# EAGLE schematic Axion (EAGLE 7.7.0)
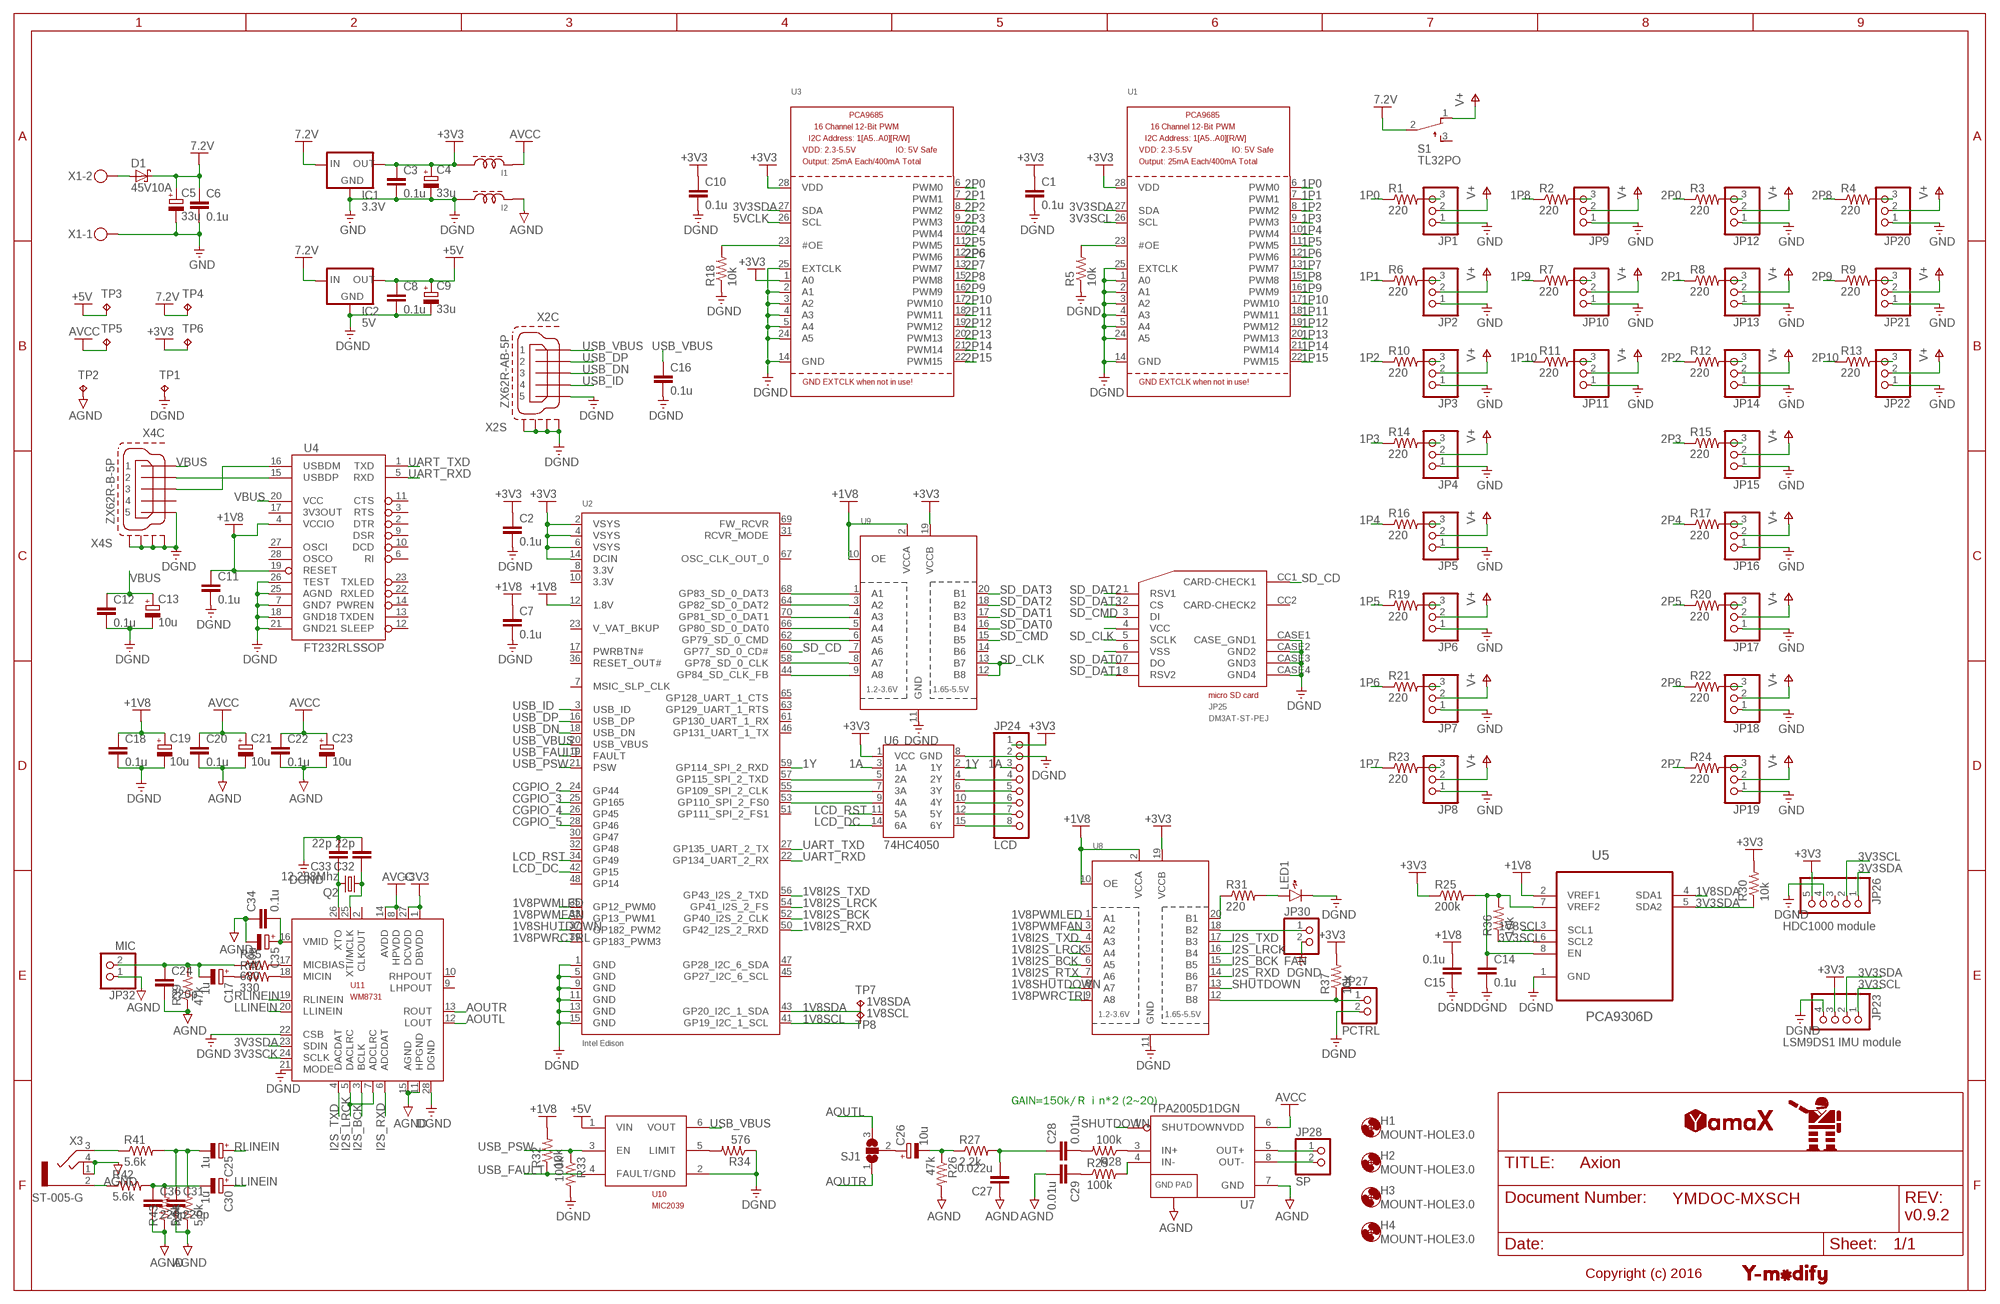
[diagram p0: schematic, sheet 1]

## Parts
C1  0.1u  C-EUC1608  [C1608]
C2  0.1u  C-EUC1608  [C1608]
C3  0.1u  C-EUC1608  [C1608]
C4  33u  CPOL-EUE2-5  [E2-5]
C5  33u  CPOL-EUE2-5  [E2-5]
C6  0.1u  C-EUC1608  [C1608]
C7  0.1u  C-EUC1608  [C1608]
C8  0.1u  C-EUC1608  [C1608]
C9  33u  CPOL-EUE2-5  [E2-5]
C10  0.1u  C-EUC1608  [C1608]
C11  0.1u  C-EUC1608  [C1608]
C12  0.1u  C-EUC1608  [C1608]
C13  10u  CPOL-EUE2-5  [E2-5]
C14  0.1u  C-EUC1608  [C1608]
C15  0.1u  C-EUC1608  [C1608]
C16  0.1u  C-EUC1608  [C1608]
C17  1u  CPOL-EUE2-5  [E2-5]
C18  0.1u  C-EUC1608  [C1608]
C19  10u  CPOL-EUE2-5  [E2-5]
C20  0.1u  C-EUC1608  [C1608]
C21  10u  CPOL-EUE2-5  [E2-5]
C22  0.1u  C-EUC1608  [C1608]
C23  10u  CPOL-EUE2-5  [E2-5]
C24  220p  C-EUC0805  [C0805]
C25  1u  CPOL-EUE2-5  [E2-5]
C26  10u  CPOL-EUE2-5  [E2-5]
C27  0.022u  C-EUC1608  [C1608]
C28  0.01u  C-EUC1608  [C1608]
C29  0.01u  C-EUC1608  [C1608]
C30  1u  CPOL-EUE2-5  [E2-5]
C31  220p  C-EUC0805  [C0805]
C32  22p  C-EUC1608  [C1608]
C33  22p  C-EUC1608  [C1608]
C34  0.1u  C-EUC1608  [C1608]
C35  10u  CPOL-EUE2-5  [E2-5]
C36  220p  C-EUC0805  [C0805]
D1  45V10A  SCHOTTKY-DIODEDO201T15  [DO201T15]
H1  MOUNT-HOLE3.0  [3,0]
H2  MOUNT-HOLE3.0  [3,0]
H3  MOUNT-HOLE3.0  [3,0]
H4  MOUNT-HOLE3.0  [3,0]
I1  BLM18  [1608(1.6*0.8MM)]
I2  BLM18  [1608(1.6*0.8MM)]
IC1  3.3V  78XXS  [78XXS]
IC2  5V  78XXS  [78XXS]
JP1  PINHD-1X3  [1X03]
JP2  PINHD-1X3  [1X03]
JP3  PINHD-1X3  [1X03]
JP4  PINHD-1X3  [1X03]
JP5  PINHD-1X3  [1X03]
JP6  PINHD-1X3  [1X03]
JP7  PINHD-1X3  [1X03]
JP8  PINHD-1X3  [1X03]
JP9  PINHD-1X3  [1X03]
JP10  PINHD-1X3  [1X03]
JP11  PINHD-1X3  [1X03]
JP12  PINHD-1X3  [1X03]
JP13  PINHD-1X3  [1X03]
JP14  PINHD-1X3  [1X03]
JP15  PINHD-1X3  [1X03]
JP16  PINHD-1X3  [1X03]
JP17  PINHD-1X3  [1X03]
JP18  PINHD-1X3  [1X03]
JP19  PINHD-1X3  [1X03]
JP20  PINHD-1X3  [1X03]
JP21  PINHD-1X3  [1X03]
JP22  PINHD-1X3  [1X03]
JP23  LSM9DS1 IMU module  PINHD-1X4  [1X04]
JP24  LCD  PINHD-1X8  [1X08]
JP25  DM3AT-ST-PEJ  [DM3AT-SF-PEJ]
JP26  HDC1000 module  PINHD-1X5  [1X05]
JP27  PCTRL  PINHD-1X2  [1X02]
JP28  SP  PINHD-1X2  [1X02]
JP30  FAN  PINHD-1X2  [1X02]
JP32  MIC  PINHD-1X2  [1X02]
LED1  LED1608  [LED1608]
Q2  12.288Mhz  CRYSTALHC49S  [HC49/S]
R1  220  R-US_M1206  [M1206]
R2  220  R-US_M1206  [M1206]
R3  220  R-US_M1206  [M1206]
R4  220  R-US_M1206  [M1206]
R5  10k  R-US_M1206  [M1206]
R6  220  R-US_M1206  [M1206]
R7  220  R-US_M1206  [M1206]
R8  220  R-US_M1206  [M1206]
R9  220  R-US_M1206  [M1206]
R10  220  R-US_M1206  [M1206]
R11  220  R-US_M1206  [M1206]
R12  220  R-US_M1206  [M1206]
R13  220  R-US_M1206  [M1206]
R14  220  R-US_M1206  [M1206]
R15  220  R-US_M1206  [M1206]
R16  220  R-US_M1206  [M1206]
R17  220  R-US_M1206  [M1206]
R18  10k  R-US_M1206  [M1206]
R19  220  R-US_M1206  [M1206]
R20  220  R-US_M1206  [M1206]
R21  220  R-US_M1206  [M1206]
R22  220  R-US_M1206  [M1206]
R23  220  R-US_M1206  [M1206]
R24  220  R-US_M1206  [M1206]
R25  200k  R-US_0309/V  [0309V]
R26  47k  R-US_R0603  [R0603]
R27  2.2k  R-US_R1206  [R1206]
R28  100k  R-US_R0603  [R0603]
R29  100k  R-US_R0603  [R0603]
R30  10k  R-US_M1206  [M1206]
R31  220  R-US_M1206  [M1206]
R32  10k  R-US_M1206  [M1206]
R33  100k  R-US_R0603  [R0603]
R34  576  R-US_M1206  [M1206]
R35  680  R-US_R1206  [R1206]
R36  10k  R-US_M1206  [M1206]
R37  10k  R-US_M1206  [M1206]
R39  47k  R-US_R0603  [R0603]
R40  330  R-US_R1206  [R1206]
R41  5.6k  R-US_R1206  [R1206]
R42  5.6k  R-US_R1206  [R1206]
R43  5.6k  R-US_R1206  [R1206]
R44  5.6k  R-US_R1206  [R1206]
S1  TL32PO  [TL3XPO]
SJ1  SJ2W  [SJ_2]
TP1  TESTPAD-R-AUTO-0.5  [ROUND-AUTO-0.5]
TP2  TESTPAD-R-AUTO-0.5  [ROUND-AUTO-0.5]
TP3  TESTPAD-R-AUTO-0.5  [ROUND-AUTO-0.5]
TP4  TESTPAD-R-AUTO-0.5  [ROUND-AUTO-0.5]
TP5  TESTPAD-R-AUTO-0.5  [ROUND-AUTO-0.5]
TP6  TESTPAD-R-AUTO-0.5  [ROUND-AUTO-0.5]
TP7  TESTPAD-R-AUTO-0.5  [ROUND-AUTO-0.5]
TP8  TESTPAD-R-AUTO-0.5  [ROUND-AUTO-0.5]
U1  PCA9685  [TSSOP28]
U2  Intel Edison  EDISON_CONNECTOR_FULLMOUNTING_HOLES  [EDISON_DAUGHTER]
U3  PCA9685  [TSSOP28]
U4  FT232RLSSOP  [SSOP28DB]
U5  PCA9306D  PCA9306D,118  [SOIC127P600X175-8N]
U6  74HC4050  HEX_CONVERTER  [SO016]
U7  TPA2005D1DGN  [POWER-SOP8]
U8  TXB0108PWR  [TSSOP20]
U9  TXB0108PWR  [TSSOP20]
U10  MIC2039  [SOT23-6]
U11  WM8731  [SSOP28]
U$1  Y-MODIFY  [Y-MODIFY]
U$2  YAMAX  [YAMAX]
U$4  MON  [MON]
X1  MKDSN1,5/2-5,08  [MKDSN1,5/2-5,08]
X2  ZX62R-AB-5P  [ZX62R-AB-5P]
X3  ST-005-G  [ST-005-G]
X4  ZX62R-B-5P  [ZX62R-B-5P]

## Nets
1A: JP24.3 U6.3(1A)
1P0: R1.1 U1.6(PWM0)
1P1: R6.1 U1.7(PWM1)
1P2: R10.1 U1.8(PWM2)
1P3: R14.1 U1.9(PWM3)
1P4: R16.1 U1.10(PWM4)
1P5: R19.1 U1.11(PWM5)
1P6: R21.1 U1.12(PWM6)
1P7: R23.1 U1.13(PWM7)
1P8: R2.1 U1.15(PWM8)
1P9: R7.1 U1.16(PWM9)
1P10: R11.1 U1.17(PWM10)
1P11: U1.18(PWM11)
1P12: U1.19(PWM12)
1P13: U1.20(PWM13)
1P14: U1.21(PWM14)
1P15: U1.22(PWM15)
1V8I2S_BCK: U2.52(GP40_I2S_2_CLK) U8.6(A5)
1V8I2S_LRCK: U2.54(GP41_I2S_2_FS) U8.5(A4)
1V8I2S_RTX: U8.7(A6)
1V8I2S_RXD: U2.50(GP42_I2S_2_RXD)
1V8I2S_TXD: U2.56(GP43_I2S_2_TXD) U8.4(A3)
1V8PWMFAN: U2.33(GP13_PWM1) U8.3(A2)
1V8PWMLED: U2.35(GP12_PWM0) U8.1(A1)
1V8PWRCTRL: U2.39(GP183_PWM3) U8.9(A8)
1V8SCL: TP8.TP U2.41(GP19_I2C_1_SCL) U5.3(SCL1)
1V8SDA: TP7.TP U2.43(GP20_I2C_1_SDA) U5.4(SDA1)
1V8SHUTDOWN: U2.37(GP182_PWM2) U8.8(A7)
1Y: U2.59(GP114_SPI_2_RXD) U6.2(1Y)
2P0: R3.1 U3.6(PWM0)
2P1: R8.1 U3.7(PWM1)
2P2: R12.1 U3.8(PWM2)
2P3: R15.1 U3.9(PWM3)
2P4: R17.1 U3.10(PWM4)
2P5: R20.1 U3.11(PWM5)
2P6: R22.1 U3.12(PWM6)
2P7: R24.1 U3.13(PWM7)
2P8: R4.1 U3.15(PWM8)
2P9: R9.1 U3.16(PWM9)
2P10: R13.1 U3.17(PWM10)
2P11: U3.18(PWM11)
2P12: U3.19(PWM12)
2P13: U3.20(PWM13)
2P14: U3.21(PWM14)
2P15: U3.22(PWM15)
3V3SCK: U11.24(SCLK)
3V3SCL: JP23.1 JP26.2 R36.1 U1.26(SCL) U5.6(SCL2)
3V3SDA: JP23.2 JP26.1 R30.1 U1.27(SDA) U3.27(SDA) U5.5(SDA2) U11.23(SDIN)
5VCLK: U3.26(SCL)
+1V8: C7.1 C11.1 C15.2 C18.1 C19.+ R32.2 U2.12(1.8V) U4.4(VCCIO) U4.19(RESET) U5.2(VREF1) U8.2(VCCA) U8.10(OE) U9.2(VCCA) U9.10(OE)
+3V3 [power]: C1.1 C2.1 C3.1 C4.+ C10.1 I1.P$3 IC1.OUT JP23.3 JP24.1 JP26.5 R25.1 R30.2 R37.2 TP6.TP U1.28(VDD) U2.2(VSYS) U2.4(VSYS) U2.6(VSYS) U2.14(DCIN) U3.1(A0) U3.28(VDD) U6.1(VCC) U8.19(VCCB) U9.19(VCCB) U11.1(DBVDD) U11.27(DCVDD)
+5V [power]: C8.1 C9.+ IC2.OUT TP3.TP U10.1(VIN)
AGND [power]: C20.2 C21.- C22.2 C23.- C24.2 C27.1 C29.2 C31.2 C34.1 C35.- C36.2 I2.P$4 JP32.1 R26.2 R39.1 R43.1 R44.1 TP2.TP U7.7(GND) U7.9(GND) U11.11(HPGND) U11.15(AGND) X3.1 X3.4
AOUTL: SJ1.3 U11.12(LOUT)
AOUTR: SJ1.1 U11.13(ROUT)
AVCC [power]: C20.1 C21.+ C22.1 C23.+ I1.P$4 TP5.TP U7.6(VDD) U11.8(HPVDD) U11.14(AVDD)
CGPIO_2: U2.24(GP44)
CGPIO_3: U2.25(GP165)
CGPIO_4: U2.26(GP45)
CGPIO_5: U2.28(GP46)
DGND [power]: C1.2 C2.2 C7.2 C8.2 C9.- C10.2 C11.2 C12.2 C13.- C14.2 C15.1 C16.2 C18.2 C19.- C32.2 C33.2 IC2.GND JP23.4 JP24.2 JP25.CASE1(CASE_GND1) JP25.CASE2(GND2) JP25.CASE3(GND3) JP25.CASE4(GND4) JP26.4 JP27.2 JP30.2 LED1.K R5.1 R18.1 R33.2 R34.1 TP1.TP U1.1(A0) U1.2(A1) U1.3(A2) U1.4(A3) U1.5(A4) U1.14(GND) U1.24(A5) U1.25(EXTCLK) U2.1(GND) U2.5(GND) U2.9(GND) U2.11(GND) U2.13(GND) U2.15(GND) U3.2(A1) U3.3(A2) U3.4(A3) U3.5(A4) U3.14(GND) U3.24(A5) U3.25(EXTCLK) U4.7(GND7) U4.18(GND18) U4.21(GND21) U4.25(AGND) U4.26(TEST) U5.1(GND) U6.8(GND) U8.11(GND) U9.11(GND) U10.2(GND) U11.21(MODE) U11.22(CSB) U11.28(DGND) X2.5 X2.S1(S:S1) X2.S2(S:S2) X2.S3(S:S3) X2.S4(S:S4) X4.5 X4.S1(S:S1) X4.S2(S:S2) X4.S3(S:S3) X4.S4(S:S4)
GND [motorpower]: C3.2 C4.- C5.- C6.2 I2.P$3 IC1.GND JP1.1 JP2.1 JP3.1 JP4.1 JP5.1 JP6.1 JP7.1 JP8.1 JP9.1 JP10.1 JP11.1 JP12.1 JP13.1 JP14.1 JP15.1 JP16.1 JP17.1 JP18.1 JP19.1 JP20.1 JP21.1 JP22.1 X1.1 ; supply symbol labelled DGND
I2S_BCK: U8.15(B5) U11.3(BCLK)
I2S_LRCK: U8.16(B4) U11.5(DACLRC) U11.7(ADCLRC)
I2S_RXD: U8.14(B6) U11.6(ADCDAT)
I2S_TXD: U8.17(B3) U11.4(DACDAT)
LCD_DC: U2.42(GP15) U6.14(6A)
LCD_RST: U2.34(GP49) U6.11(5A)
LLINEIN: C30.+ U11.20(LLINEIN)
N$1: JP1.3 R1.2
N$2: D1.A X1.2
N$3: JP2.3 R6.2
N$4: R5.2 U1.23(#OE)
N$5: JP3.3 R10.2
N$6: R18.2 U3.23(#OE)
N$7: JP4.3 R14.2
N$8: U4.15(USBDP) U4.16(USBDM) X4.2 X4.3
N$9: JP5.3 R16.2
N$10: C14.1 R25.2 R36.2 U5.7(VREF2) U5.8(EN)
N$11: JP6.3 R19.2
N$12: U2.53(GP110_SPI_2_FS0) U6.9(4A)
N$13: JP7.3 R21.2
N$14: U2.55(GP109_SPI_2_CLK) U6.7(3A)
N$15: JP8.3 R23.2
N$16: JP24.8 U6.15(6Y)
N$17: JP9.3 R2.2
N$18: JP10.3 R7.2
N$19: JP11.3 R11.2
N$20: JP20.3 R4.2
N$21: JP21.3 R9.2
N$22: JP22.3 R13.2
N$23: JP24.7 U6.12(5Y)
N$24: JP24.6 U6.10(4Y)
N$25: JP24.5 U6.6(3Y)
N$26: JP12.3 R3.2
N$27: JP13.3 R8.2
N$28: JP14.3 R12.2
N$29: JP15.3 R15.2
N$30: JP16.3 R17.2
N$31: JP17.3 R20.2
N$32: JP18.3 R22.2
N$33: JP19.3 R24.2
N$34: JP24.4 U6.4(2Y)
N$35: JP27.1 R37.1 U8.12(B8)
N$37: U2.68(GP83_SD_0_DAT3) U9.1(A1)
N$38: C17.+ R40.1
N$39: U2.57(GP115_SPI_2_TXD) U6.5(2A)
N$40: U2.64(GP82_SD_0_DAT2) U9.3(A2)
N$41: U2.70(GP81_SD_0_DAT1) U9.4(A3)
N$42: U2.66(GP80_SD_0_DAT0) U9.5(A4)
N$43: U2.62(GP79_SD_0_CMD) U9.6(A5)
N$44: U2.58(GP78_SD_0_CLK) U9.8(A7)
N$45: U2.44(GP84_SD_CLK_FB) U9.9(A8)
N$46: C26.+ SJ1.2
N$47: C26.- R26.1 R27.1
N$48: R28.1 U7.3(IN+)
N$49: JP25.4(VCC)
N$50: R29.2 U7.4(IN-)
N$51: JP25.6(VSS)
N$52: C28.2 R28.2
N$53: C29.1 R29.1
N$54: C27.2 C28.1 R27.2
N$55: JP28.1 U7.5(OUT+)
N$56: JP28.2 U7.8(OUT-)
N$59: R41.1 X3.3
N$60: R42.1 X3.2
N$61: C30.- C36.1 R42.2 R43.2
N$63: C25.- C31.1 R41.2 R44.2
N$64: R31.1 U8.20(B1)
N$65: LED1.A R31.2
N$66: JP30.1 U8.18(B2)
N$67: C33.1 Q2.2 U11.26(XTO)
N$68: R34.2 U10.5(LIMIT)
N$69: C32.1 Q2.1 U11.25(XTI/MCLK)
N$70: C34.2 C35.+ U11.16(VMID)
N$72: R35.2 U11.17(MICBIAS)
N$73: R40.2 U11.18(MICIN)
N$74: C17.- C24.1 JP32.2 R35.1 R39.2
RLINEIN: C25.+ U11.19(RLINEIN)
SD_CD: JP25.CC1(CARD-CHECK1) U2.60(GP77_SD_0_CD#)
SD_CLK: JP25.5(SCLK) U9.12(B8) U9.13(B7)
SD_CMD: JP25.3(DI) U9.15(B5)
SD_DAT0: JP25.7(DO) U9.16(B4)
SD_DAT1: JP25.8(RSV2) U9.17(B3)
SD_DAT2: JP25.1(RSV1) U9.18(B2)
SD_DAT3: JP25.2(CS) U9.20(B1)
SHUTDOWN: U7.1(SHUTDOWN) U8.13(B7)
UART_RXD: U2.22(GP134_UART_2_RX) U4.5(RXD)
UART_TXD: U2.27(GP135_UART_2_TX) U4.1(TXD)
USB_DN: U2.18(USB_DN) X2.3
USB_DP: U2.16(USB_DP) X2.2
USB_FAULT: R32.1 U2.19(FAULT) U10.4(FAULT/)
USB_ID: U2.3(USB_ID) X2.4
USB_PSW: R33.1 U2.21(PSW) U10.3(EN)
USB_VBUS: C16.1 U2.20(USB_VBUS) U10.6(VOUT) X2.1
V+ [motorpower]: JP1.2 JP2.2 JP3.2 JP4.2 JP5.2 JP6.2 JP7.2 JP8.2 JP9.2 JP10.2 JP11.2 JP12.2 JP13.2 JP14.2 JP15.2 JP16.2 JP17.2 JP18.2 JP19.2 JP20.2 JP21.2 JP22.2 S1.1(O)
VBUS: C12.1 C13.+ U4.20(VCC) X4.1
VCC [motorpower]: C5.+ C6.1 D1.C IC1.IN IC2.IN S1.2(P) TP4.TP ; supply symbol labelled 7.2V
Unconnected: JP25.CC2(CARD-CHECK2) JP26.3 S1.3(S) U2.7(MSIC_SLP_CLK) U2.8(3.3V) U2.10(3.3V) U2.17(PWRBTN#) U2.23(V_VAT_BKUP) U2.30(GP47) U2.31(RCVR_MODE) U2.32(GP48) U2.36(RESET_OUT#) U2.45(GP27_I2C_6_SCL) U2.46(GP131_UART_1_TX) U2.47(GP28_I2C_6_SDA) U2.48(GP14) U2.51(GP111_SPI_2_FS1) U2.61(GP130_UART_1_RX) U2.63(GP129_UART_1_RTS) U2.65(GP128_UART_1_CTS) U2.67(OSC_CLK_OUT_0) U2.69(FW_RCVR) U4.2(DTR) U4.3(RTS) U4.6(RI) U4.9(DSR) U4.10(DCD) U4.11(CTS) U4.12(SLEEP) U4.13(TXDEN) U4.14(PWREN) U4.17(3V3OUT) U4.22(RXLED) U4.23(TXLED) U4.27(OSCI) U4.28(OSCO) U9.7(A6) U9.14(B6) U11.2(CLKOUT) U11.9(LHPOUT) U11.10(RHPOUT) X4.4

## Notes on the sheet
- GAIN=150k/Ｒｉn*2 (2~20)
- YMDOC-MXSCH
- v0.9.2
- Copyright (c) 2016

## Library data of the parts
C1-C3 C6-C8 C10-C12 C14-C16 C18 C20 C22 C24 C27-C29 C31-C34 C36 = resistor:C-EU: CAPACITOR, European symbol
C4 C5 C9 C13 C17 C19 C21 C23 C25 C26 C30 C35 = resistor:CPOL-EU: POLARIZED CAPACITOR, European symbol
D1 = diode-1:SCHOTTKY-DIODE: Schottky Diode
H1-H4 = holes:MOUNT-HOLE: MOUNTING HOLE with drill center marker
I1 I2 = Inductor:BLM: 1608 size Ferrite Bead
IC1 IC2 = v-reg:78XXS: VOLTAGE REGULATOR
JP1-JP22 = pinhead:PINHD-1X3: PIN HEADER
JP23 = pinhead:PINHD-1X4: PIN HEADER
JP24 = pinhead:PINHD-1X8: PIN HEADER
JP25 = SD Card Socket:DM3AT-ST-PEJ: DM3AT-SF-PEJ DM3AT series , microSD card socket Producted by Hirose(HRS).Co CC : card check (closed at insert ; short CC1 and CC2)
JP26 = pinhead:PINHD-1X5: PIN HEADER
JP27 JP28 JP30 JP32 = pinhead:PINHD-1X2: PIN HEADER
LED1 = generic:LED: Generic LEDs
Q2 = adafruit:CRYSTAL: CRYSTAL; OC_FARNELL: 1667008; OC_NEWARK: unknown
R1-R37 R39-R44 = resistor:R-US_: RESISTOR, American symbol
S1 = switch:TL32PO: TINY SWITCH ON - MOM Source: http://www2.produktinfo.conrad.com/datenblaetter/700000-724999/705152-da-01-de-Subminiaturschalter_TL_36YO.pdf
SJ1 = Jumper:SJ2W: SMD solder JUMPER
TP1 = testpad:TESTPAD-*: Test pad; TP_SIGNAL_NAME: GND
TP2 = testpad:TESTPAD-*: Test pad; TP_SIGNAL_NAME: AGND
TP3 = testpad:TESTPAD-*: Test pad; TP_SIGNAL_NAME: 5V
TP4 = testpad:TESTPAD-*: Test pad; TP_SIGNAL_NAME: 7V2
TP5 = testpad:TESTPAD-*: Test pad; TP_SIGNAL_NAME: AVCC
TP6 = testpad:TESTPAD-*: Test pad; TP_SIGNAL_NAME: 3V3
TP7 = testpad:TESTPAD-*: Test pad; TP_SIGNAL_NAME: 1V8SDA
TP8 = testpad:TESTPAD-*: Test pad; TP_SIGNAL_NAME: 1V8SCL
U1 U3 = adafruit:PCA9685: PCA9685 - 16 Channel 12-Bit I2C PWM Controller 5.0V tolerant 16 channel, 12-bit I2C PWM controller with 25mA per output (max. 400mA total) Digikey: 568-5931-1-ND
U2 = SparkFun-Boards:EDISON_CONNECTOR_FULL
U4 = SparkFun-DigitalIC:FT232RL: USB UART FT232RL 4th Generation USB UART (USB <-> Serial) Controller. Spark Fun Electronics SKU : COM-00650 Production SKU IC-00870; PROD_ID: IC-00870
U5 = NXP_By_element14_Batch_1:PCA9306D,118: Dual bidirectional I2C-bus and SMBus voltage-level translator; MPN: PCA9306D,118; OC_FARNELL: 1831194; OC_NEWARK: 70R6428; PACKAGE: SOIC-8; SUPPLIER: NXP
U6 = SparkFun-DigitalIC:HEX_CONVERTER: 74HC4050 Hex Buffer Level Shifter SMD SO016; PROD_ID: IC-09604
U7 = SparkFun-AnalogIC:TPA2005D1: 1.4W MONO CLASS-D AUDIO POWER AMPLIFIER The TPA2005D1 is a 1.4-W high efficiency filter-free class-D audio power amplifier in a BGA, QFN, or MSOP package that requires only three external components. Datasheet: http://focus.ti.com/lit/ds/symlink/tpa2005d1.pdf 1.4 W Into 8 ? From a 5V Supply at THD = 10% (Typ) Maximum Battery Life and Minimum Heat Efficiency With an 8-? Speaker: 84% at 400 mW, 79% at 100 mW 2.8-mA Quiescent Current 0.5-mA Shutdown Current Ideal for Wireless or Cellular Handsets and PDAs Capable of Driving an 8-? Speaker (2.5 V ? VDD ? 5.5 V) and a 4-? Speaker (2.5 V ? VDD ? 4.2 V) Only Three External Components Optimized PWM Output Stage Eliminates LC Output Filter Internally Generated 250-kHz Switching Frequency Eliminates Capacitor and Resistor Improved PSRR (-71 dB at 217 Hz) and Wide Supply Voltage (2.5 V to 5.5 V) Eliminates Need for a Voltage Regulator Fully Differential Design Reduces RF Rectification and Eliminates Bypass Capacitor Improved CMRR Eliminates Two Input Coupling Capacitors
U8 U9 = adafruit:TXB0108PWR: 8-Bit Bi-Directional Level Shifter 1.2V-3.6V (VCCA) to 1.65V-5.5V (VCCB) bi-directional level shifter with auto direction sensing. Max data rate - VCCA 1.8V: 20Mbps (50ns), VCCA 3.3V: 100Mbps (10ns) Digikey: 296-21527-1-ND
U10 = MIC2039:MIC2039: MIC2039 The MIC2039 is a high-side MOSFET power distribution switch providing increased system reliability by using 5% current limit accuracy. http://www.microchip.com/wwwproducts/en/MIC2039
U11 = Oles komponentbibliotek:WM8731: Low power stereo CODEC with an integrated headphone driver.
U$1 = y-modify_logos:Y-MODIFY
U$2 = y-modify_logos:YAMAX
U$4 = y-modify_logos:MON
X1 = con-phoenix-508:MKDSN1,5/2-5,08: MKDSN 1,5/ 2-5,08 Printklemme Nennstrom: 13,5 A Nennspannung: 250 V Rastermaß: 5,08 mm Polzahl: 2 Anschlussart: Schraubanschluss Montage: Löten Anschlussrichtung Leiter/Platine: 0 ° Artikelnummer: 1729128 Source: http://eshop.phoenixcontact.com .. 1729128.pdf
X2 = hirose-zx:ZX62R-AB-5P: Micro USB Connector HI-SPEED Certified Source: https://www.hirose.co.jp/catalogj_hp/jd_ZX_20140305.pdf
X3 = audio-connectors:ST-005-G: Stereo mini jack 3.5 mm Source: http://akizukidenshi.com/download/ds/switronic/ST-005-G.pdf
X4 = hirose-zx:ZX62R-B-5P: Micro USB Connector HI-SPEED Certified Source: https://www.hirose.co.jp/catalogj_hp/jd_ZX_20140305.pdf

## Net classes
1 motorpower: width 0.914 mm, drill 0.457 mm
2 power: width 0.305 mm, drill 0.152 mm